# EAGLE design Arduino_Mini (EAGLE 9.1.3)
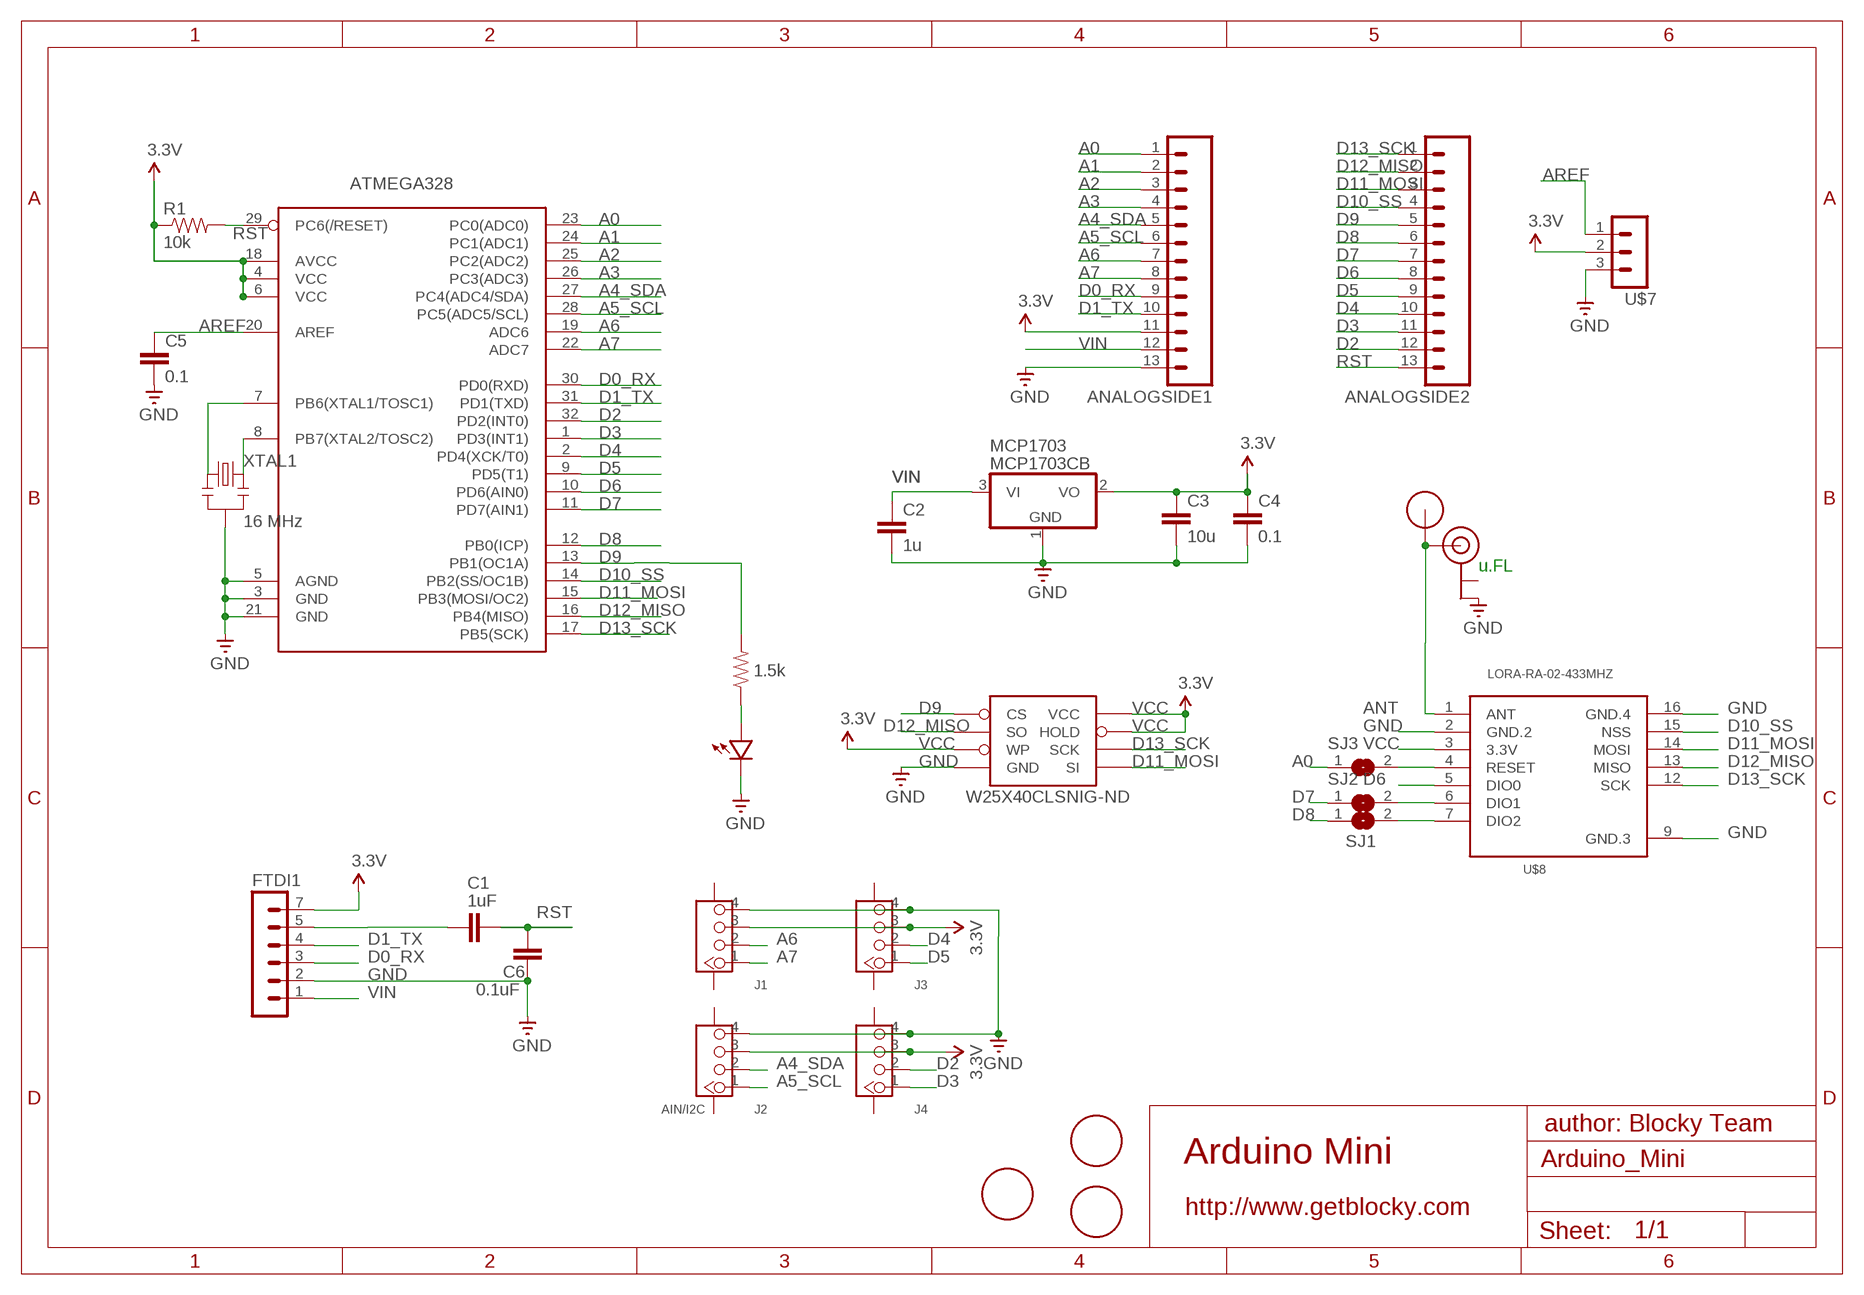
[diagram p0: schematic, sheet 1]

## Parts
ANALOGSIDE1  HDR_13PINTHIN_RINGS  [1X13_THINRINGS]
ANALOGSIDE2  HDR_13PINTHIN_RINGS  [1X13_THINRINGS]
ATMEGA328  ATMega-328  ATMEGA168/328TQFP32  [TQFP32-08]
C1  1uF  CAP0603-CAP  [0603-CAP]
C2  1u  CAP0603-CAP  [0603-CAP]
C3  10u  CAP0805-CAP  [0805-CAP]
C4  0.1  CAP0603-CAP  [0603-CAP]
C5  0.1  CAP0603-CAP  [0603-CAP]
C6  0.1uF  CAP0603-CAP  [0603-CAP]
FTDI1  HDR_6PINTHINRINGS  [1X06_NS_THINRINGS]
J1  4P-SMD-2.0-90D  GROVE-CONNECTOR-SMD-90D(4+2P-2.0)  [HW4-SMD-2.0-90D]
J2  AIN/I2C  GROVE-CONNECTOR-SMD-90D(4+2P-2.0)  [HW4-SMD-2.0-90D]
J3  4P-SMD-2.0-90D  GROVE-CONNECTOR-SMD-90D(4+2P-2.0)  [HW4-SMD-2.0-90D]
J4  4P-SMD-2.0-90D  GROVE-CONNECTOR-SMD-90D(4+2P-2.0)  [HW4-SMD-2.0-90D]
LED  LED0603  [0603-LED]
MCP1703  MCP1703CB  [SOT23]
R1  10k  RESISTOR0603-RES  [0603-RES]
R2  1.5k  RESISTOR0603-RES  [0603-RES]
SJ1  SOLDERJUMPERREFLOW  [SOLDERJUMPER_REFLOW]
SJ2  SOLDERJUMPERREFLOW  [SOLDERJUMPER_REFLOW]
SJ3  SOLDERJUMPERREFLOW  [SOLDERJUMPER_REFLOW]
U$1  RFM12B_ANTENNA""  [RFM12B-ANTENNA]
U$2  FIDUCIAL1.5MM  [FIDUCIAL_1.5MM]
U$4  U.FL  [U.FL]
U$5  FIDUCIAL1.5MM  [FIDUCIAL_1.5MM]
U$6  FIDUCIAL1.5MM  [FIDUCIAL_1.5MM]
U$7  HDR_3PINTHINRINGS  [1X03_NS_THINRINGS]
U$8  LORA-RA-02-433MHZ  [LORA-RA2-SMD]
W25X40CLSNIG-ND  AT25F512BJEDEC_3.9MM  [SO08]
XTAL1  16 MHz  RESONATORSMD  [RESONATOR-SMD]

## Nets
A0: ANALOGSIDE1.1 ATMEGA328.23(PC0(ADC0)) SJ3.1
A1: ANALOGSIDE1.2 ATMEGA328.24(PC1(ADC1))
A2: ANALOGSIDE1.3 ATMEGA328.25(PC2(ADC2))
A3: ANALOGSIDE1.4 ATMEGA328.26(PC3(ADC3))
A4_SDA: ANALOGSIDE1.5 ATMEGA328.27(PC4(ADC4/SDA)) J2.2
A5_SCL: ANALOGSIDE1.6 ATMEGA328.28(PC5(ADC5/SCL)) J2.1
A6: ANALOGSIDE1.7 ATMEGA328.19(ADC6) J1.2
A7: ANALOGSIDE1.8 ATMEGA328.22(ADC7) J1.1
ANT [power]: U$1.P$1 U$4.SIGNAL U$8.1(ANT)
AREF: ATMEGA328.20(AREF) C5.1 U$7.1
D0_RX: ANALOGSIDE1.9 ATMEGA328.30(PD0(RXD)) FTDI1.3
D1_TX: ANALOGSIDE1.10 ATMEGA328.31(PD1(TXD)) FTDI1.4
D2: ANALOGSIDE2.12 ATMEGA328.32(PD2(INT0)) J4.2
D3: ANALOGSIDE2.11 ATMEGA328.1(PD3(INT1)) J4.1
D4: ANALOGSIDE2.10 ATMEGA328.2(PD4(XCK/T0)) J3.2
D5: ANALOGSIDE2.9 ATMEGA328.9(PD5(T1)) J3.1
D6: ANALOGSIDE2.8 ATMEGA328.10(PD6(AIN0)) U$8.5(DIO0)
D7: ANALOGSIDE2.7 ATMEGA328.11(PD7(AIN1)) SJ2.1
D8: ANALOGSIDE2.6 ATMEGA328.12(PB0(ICP)) SJ1.1
D9: ANALOGSIDE2.5 ATMEGA328.13(PB1(OC1A)) R2.2 W25X40CLSNIG-ND.1_CS(CS)
D10_SS: ANALOGSIDE2.4 ATMEGA328.14(PB2(SS/OC1B)) U$8.15(NSS)
D11_MOSI: ANALOGSIDE2.3 ATMEGA328.15(PB3(MOSI/OC2)) U$8.14(MOSI) W25X40CLSNIG-ND.5_SI(SI)
D12_MISO: ANALOGSIDE2.2 ATMEGA328.16(PB4(MISO)) U$8.13(MISO) W25X40CLSNIG-ND.2_SO(SO)
D13_SCK: ANALOGSIDE2.1 ATMEGA328.17(PB5(SCK)) U$8.12(SCK) W25X40CLSNIG-ND.6_SCK(SCK)
DIO1: SJ2.2 U$8.6(DIO1)
DIO2: SJ1.2 U$8.7(DIO2)
GND: ANALOGSIDE1.13 ATMEGA328.3(GND) ATMEGA328.5(AGND) ATMEGA328.21(GND) C2.2 C3.2 C4.2 C5.2 C6.2 FTDI1.2 J1.4 J2.4 J3.4 J4.4 LED.MINUS MCP1703.1(GND) U$4.GND2(GND) U$7.3 U$8.2(GND.2) U$8.9(GND.3) U$8.16(GND.4) W25X40CLSNIG-ND.4_GND(GND) XTAL1.2
N$1: ATMEGA328.7(PB6(XTAL1/TOSC1)) XTAL1.1
N$2: LED.PLUS R2.1
N$3: SJ3.2 U$8.4(RESET)
N$5: C1.2 FTDI1.5
N$21: ATMEGA328.8(PB7(XTAL2/TOSC2)) XTAL1.3
RST: ANALOGSIDE2.13 ATMEGA328.29(PC6(/RESET)) C1.1 C6.1 R1.2
VCC [power]: ANALOGSIDE1.11 ATMEGA328.4(VCC) ATMEGA328.6(VCC) ATMEGA328.18(AVCC) C3.1 C4.1 FTDI1.7 J1.3 J2.3 J3.3 J4.3 MCP1703.2(VO) R1.1 U$7.2 U$8.3(3.3V) W25X40CLSNIG-ND.3_WP(WP) W25X40CLSNIG-ND.7_HOLD(HOLD) W25X40CLSNIG-ND.8_VCC(VCC) ; supply symbol labelled 3.3V
VIN [power]: ANALOGSIDE1.12 C2.1 FTDI1.1 MCP1703.3(VI)
Unconnected: J1.SS1 J1.SS2 J2.SS1 J2.SS2 J3.SS1 J3.SS2 J4.SS1 J4.SS2 U$2.P$1(FIDUCIAL) U$4.GND1(GND) U$5.P$1(FIDUCIAL) U$6.P$1(FIDUCIAL)

## Notes on the sheet
- u.FL
- author: Blocky Team
- Arduino Mini
- http://www.getblocky.com

## Library data of the parts
ANALOGSIDE1 ANALOGSIDE2 = LowPowerLab:HDR_13PIN
ATMEGA328 = LowPowerLab:ATMEGA168/328: Atmel 32-pin 8-bit micro, 16k flash.
C1-C6 = LowPowerLab:CAP: Capacitor Standard 0603 ceramic capacitor, and 0.1" leaded capacitor.
FTDI1 = LowPowerLab:HDR_6PIN
J1 J3 J4 = Seeed-Connector:GROVE-CONNECTOR-SMD-90D(4+2P-2.0): 320110032
J2 = Seeed-Connector:GROVE-CONNECTOR-SMD-90D(4+2P-2.0): 320110032; VALUE: 4P-SMD-2.0-90D
LED = LowPowerLab:LED
MCP1703 = linear:MCP1703: 250 mA, 16V, Low Quiescent Current LDO Regulator Source: http://ww1.microchip.com/downloads/en/DeviceDoc/22049b.pdf
R1 R2 = LowPowerLab:RESISTOR: Resistor Basic schematic elements and footprints for 0603, 1206, and PTH resistors.
SJ1-SJ3 = microbuilder:SOLDERJUMPER: SMD Solder JUMPER Solder the two pads together to create a connection, or remove the solder to break it. REFLOW - Use this footprint for solder paste and reflow ovens. WAVE - Use this footprint for hand-soldering (larger pads). CLOSED - Has a trace between the two pads to ensure it is closed by default. The trace needs to be cut to disable the jumper, and can be closed again by creating a solder bridge between the two pads.
U$1 = LowPowerLab:RFM12B_ANTENNA
U$2 U$5 U$6 = LowPowerLab:FIDUCIAL
U$4 = LowPowerLab:U.FL: SMD antenna connector- WRL-09144
U$7 = LowPowerLab:HDR_3PIN
U$8 = LikeCircuit:LORA-RA-02-433MHZ: 433 MHz Lora Ra-02 Radio Transceiver Module based on SX1276 chip. Visit our more eagle PCB <https://www.likecircuit.com/>
W25X40CLSNIG-ND = LowPowerLab:AT25F512B: 4-Mbit SPI flash memory
XTAL1 = SparkFun:RESONATOR: Resonator Small SMD resonator. This is the itty bitty 10/20MHz resonators with built in caps. CSTCE10M0G55 and CSTCE20M0V53. Footprint has been reviewed closely but hasn't been tested yet.

## Net classes
1 power: width 0.381 mm, clearance 0.254 mm
10 supply: width 0.254 mm

## Board
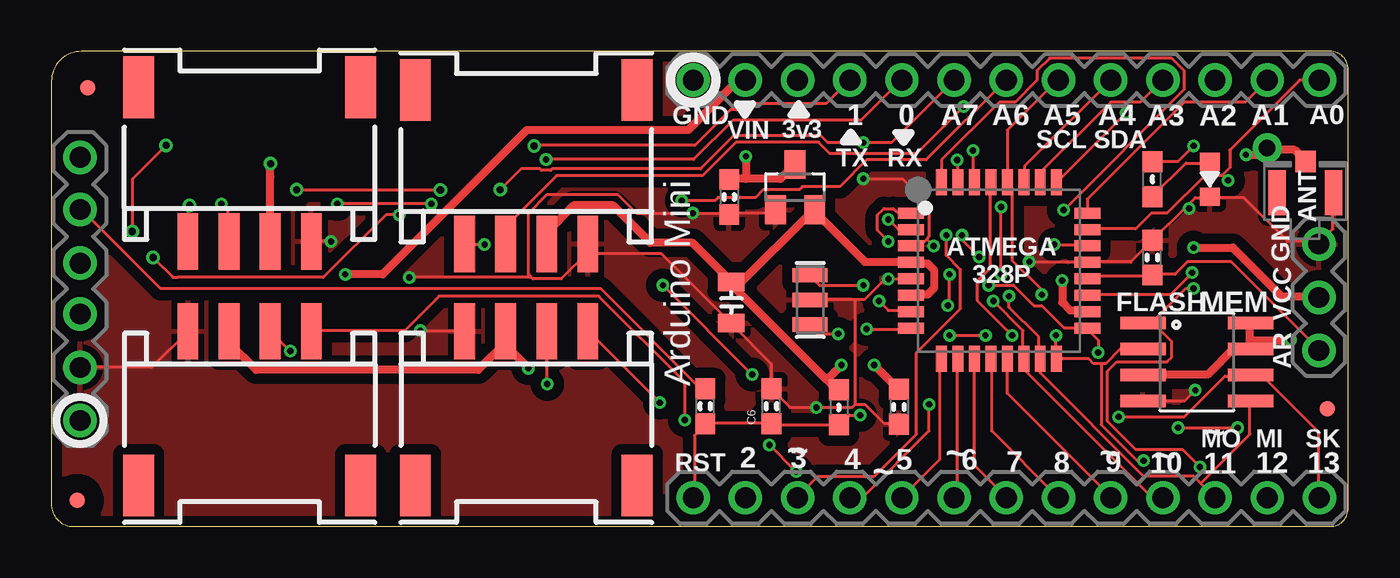
[diagram p1: board, top side]
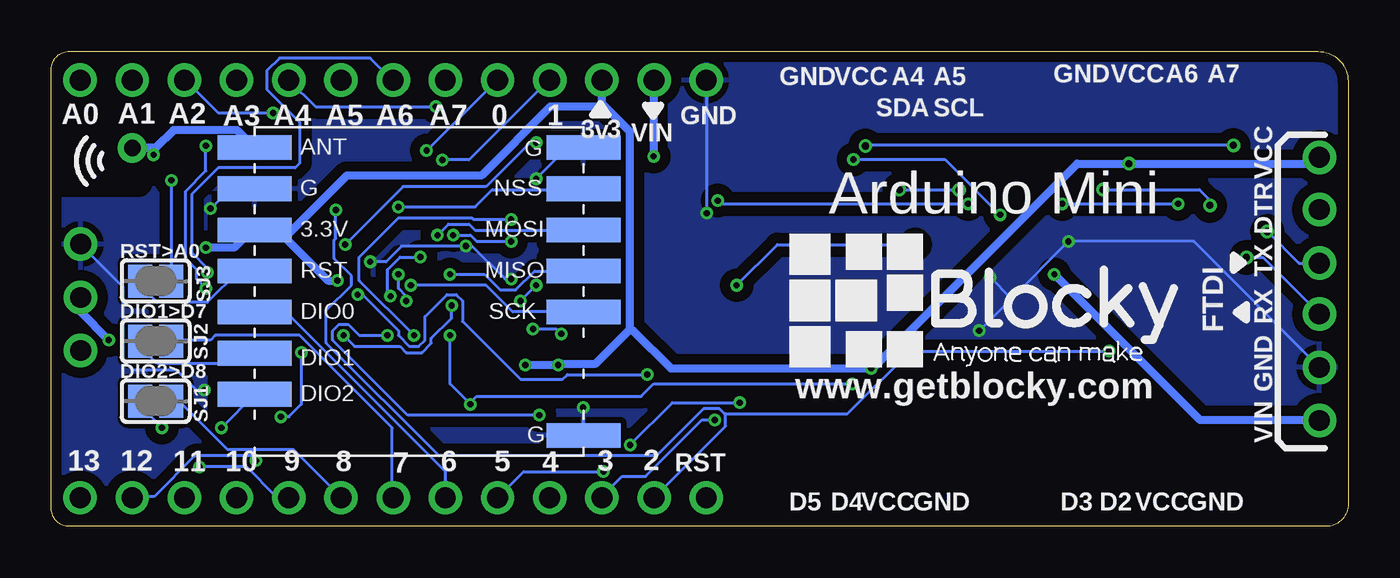
[diagram p2: board, bottom side, seen from below]

Size 63.12 x 23.11 mm. Coordinates in mm from the lower left corner, seen from the top.
Outline: 62.25,23.11 1.46,23.11 arc90 0,21.66 0,1.07 arc90 1.07,0 62.25,0 arc90 63.12,0.87 63.12,22.25 arc90 62.25,23.11
Copper layers (1*16): Top 0.035mm / dielectric 1.5mm / Bottom 0.035mm
Design rules "ITEADstudio_DRC *": minimum track width 6mil, minimum drill 12mil, track to track 6mil, track to pad 6mil, pad to pad 6mil, via to via 6mil, smd to smd 0mil, copper to edge 10mil, drill to drill 10mil, minimum pad ring 10mil, minimum via ring 6mil, stop-mask expansion 2mil, vias tented up to drill 100mil, thermal gap 12mil
tRestrict: area 60.3,15.1 to 61.7,16.9; area 59.1,18.7 to 62.7,19.2; area 62.3,17.4 to 62.5,17.5
bRestrict: area 58.8,16.7 to 62.8,19.4

### Footprints (pad centres in the part's own frame; a part is rotated, then mirrored left to right if it is on the bottom)
1X13_THINRINGS = drill 1.016 pad 1.626: 1 0,0; 2 2.54,0; 3 5.08,0; 4 7.62,0; 5 10.16,0; 6 12.7,0; 7 15.24,0; 8 17.78,0; 9 20.32,0; 10 22.86,0; 11 25.4,0; 12 27.94,0; 13 30.48,0
TQFP32-08 = smd 1.27 x 0.533: 1 -4.293,2.8; 2 -4.293,2; 3 -4.293,1.2; 4 -4.293,0.4; 5 -4.293,-0.4; 6 -4.293,-1.2; 7 -4.293,-2; 8 -4.293,-2.8; 17 4.293,-2.8; 18 4.293,-2; 19 4.293,-1.2; 20 4.293,-0.4; 21 4.293,0.4; 22 4.293,1.2; 23 4.293,2; 24 4.293,2.8 | smd 0.533 x 1.27: 9 -2.8,-4.293; 10 -2,-4.293; 11 -1.2,-4.293; 12 -0.4,-4.293; 13 0.4,-4.293; 14 1.2,-4.293; 15 2,-4.293; 16 2.8,-4.293; 25 2.8,4.293; 26 2,4.293; 27 1.2,4.293; 28 0.4,4.293; 29 -0.4,4.293; 30 -1.2,4.293; 31 -2,4.293; 32 -2.8,4.293
0603-CAP = smd 1.016 x 0.965: 1 -0.85,0; 2 0.85,0
0805-CAP = smd 0.902 x 1.3: 1 -1,0; 2 1,0
1X06_NS_THINRINGS = drill 1.016 pad 1.626: 1 -0.051,0; 2 2.527,0; 3 5.131,0; 4 7.607,0; 5 10.211,0; 7 12.751,0
HW4-SMD-2.0-90D = smd 1.01 x 2.74: 1 -3,-0.1; 2 -1,-0.1; 3 1,-0.1; 4 3,-0.1 | smd 1.5 x 3: SS1 -5.4,7.4; SS2 5.4,7.4
0603-LED = smd 0.864 x 0.965: MINUS -0.85,0; PLUS 0.85,0
SOT23 = smd 1 x 1.4: 1 -0.95,-1.1; 2 0.95,-1.1; 3 0,1.1
0603-RES = smd 1.016 x 0.965: 1 -0.85,0; 2 0.85,0
SOLDERJUMPER_REFLOW = smd 1.168 x 1.6: 1 -0.762,0; 2 0.762,0
RFM12B-ANTENNA = drill 0.8 pad 1.422: P$1 0,0
FIDUCIAL_1.5MM = smd 0.762 x 0.762: P$1 0,0
U.FL = smd 2.2 x 0.85: GND1 0,1.375; GND2 0,-1.375 | smd 1.05 x 1: SIGNAL 1.525,0
1X03_NS_THINRINGS = drill 1.016 pad 1.626: 1 -0.051,0; 2 2.527,0; 3 5.131,0
LORA-RA2-SMD = smd 3.6 x 1.2: 1 -8,7; 2 -8,5; 3 -8,3; 4 -8,1; 5 -8,-1; 6 -8,-3; 7 -8,-5; 9 8,-7; 12 8,-1; 13 8,1; 14 8,3; 15 8,5; 16 8,7
SO08 = smd 0.61 x 2.21: 1_CS -1.905,-2.616; 2_SO -0.635,-2.616; 3_WP 0.635,-2.616; 4_GND 1.905,-2.616; 5_SI 1.905,2.616; 6_SCK 0.635,2.616; 7_HOLD -0.635,2.616; 8_VCC -1.905,2.616
RESONATOR-SMD = smd 0.7 x 1.7: 1 -1.2,0; 2 0,0; 3 1.2,0

### Placement (x,y rotation side)
ANALOGSIDE1  61.72,21.72 180 top
ANALOGSIDE2  61.72,1.4 180 top
ATMEGA328  46.13,12.45 0 top
C1  31.83,5.84 90 top
C2  32.99,16.03 270 top
C3  33.1,10.9 270 top
C4  41.25,5.82 270 top
C5  53.59,13.08 90 top
C6  35.05,5.84 90 top
FTDI1  1.4,5.21 90 top
J1  9.65,13.97 0 top
J2  23.11,13.84 0 top
J3  23.11,9.4 180 top
J4  9.65,9.4 180 top
LED  56.39,16.89 90 top
MCP1703  36.2,16.51 0 top
R1  38.33,5.79 270 top
R2  53.59,16.89 90 top
SJ1  58.04,6.1 180 bottom
SJ2  58.04,9.02 180 bottom
SJ3  58.04,11.94 180 bottom
U$1  59.18,18.41 0 top
U$2  1.27,1.27 0 top
U$3  [BLOCKY_LOGO]  28.19,7.49 0 bottom
U$4  61.04,16.23 90 top
U$5  1.78,21.34 0 top
U$6  62.1,5.71 0 top
U$7  61.7,8.61 90 top
U$8  45.21,11.43 0 bottom
W25X40CLSNIG-ND  55.75,8 270 top
XTAL1  36.93,11.02 270 top

### Tracks (layer width: path | path; a pad name or v marks a point on that pad's centre or on a via)
A0  (via drill 0.3)
  Top 0.152: 57.01,17.11 57.35,17.45 57.35,18.31 60.76,21.72 61.7,21.72 ANALOGSIDE1.1 | 57.01,17.11 56.97,17.07 56.13,17.07 54.3,15.24 53.54,15.24 52.78,14.48 50.42,14.48 ATMEGA328.23 | v57.28,16.84 57.05,17.07 57.01,17.11
  Bottom 0.152: v57.28,16.84 57.28,11.96 SJ3.1
A1
  Top 0.152: ANALOGSIDE1.2 58.11,20.65 55.14,20.65 50.42,15.93 50.42,15.32 ATMEGA328.24
A2  (via drill 0.3)
  Top 0.152: v52.32,20.12 48.97,16.76 ATMEGA328.25
  Bottom 0.152: v52.32,20.12 54.99,20.12 56.59,21.72 ANALOGSIDE1.3
A3
  Top 0.152: ATMEGA328.26 48.13,16.76 48.13,17.22 51.56,20.65 53.01,20.65 54.08,21.72 ANALOGSIDE1.4
A4_SDA  (via drill 0.3)
  Top 0.152: ANALOGSIDE1.5 47.37,17.53 47.37,16.76 ATMEGA328.27 | v44.4,20.42 42.11,18.14 37.9,18.14 37.34,18.69 33.32,18.69 31.7,17.07 24.59,17.07 22.15,14.63 22.15,13.79 J2.2
  Bottom 0.152: v44.4,20.42 50.27,20.42 ANALOGSIDE1.5
A5_SCL  (via drill 0.3)
  Top 0.152: ANALOGSIDE1.6 48.97,21.72 46.53,19.28 46.53,16.76 ATMEGA328.28 46.53,16.69 46.76,16.46 46.76,12.95 48.21,11.51 v48.21,11.28 | v21.08,13.72 20.17,13.72 J2.1 | v34.11,7.39 v29.77,11.73
  Bottom 0.152: v21.08,13.72 27.79,13.72 v29.77,11.73 | v34.11,7.39 38,7.39 38.23,7.16 40.28,7.16 43.1,9.98 43.1,10.97 43.41,11.28 43.87,11.28 44.93,10.21 44.93,9.07 45.24,8.76 45.7,8.76 46.23,9.3 46.23,9.53 47.98,11.28 v48.21,11.28
A6  (via drill 0.3)
  Top 0.152: v55.52,12.34 54.46,11.28 50.42,11.28 ATMEGA328.19 | v8.28,15.7 8.58,15.39 8.58,13.95 J1.2 | v18.49,15.7 v13.92,15.7 | v30.68,15.85 32.28,15.85 32.44,16 34.27,16 34.65,16.38 36.4,16.38 36.55,16.54 38.38,16.54 39.67,17.83 42.57,17.83 46.46,21.72 ANALOGSIDE1.7
  Bottom 0.152: v55.52,12.34 55.52,12.57 56.29,13.34 56.29,16.15 54.99,17.45 51.26,17.45 51.03,17.68 51.03,19.66 52.63,21.26 52.63,22.17 52.02,22.78 47.6,22.78 46.53,21.72 ANALOGSIDE1.7 | v13.92,15.7 v8.28,15.7 | v18.49,15.7 30.53,15.7 v30.68,15.85
A7  (via drill 0.3, 0.35)
  Top 0.152: v48.82,13.72 50.42,13.72 ATMEGA328.22 | ANALOGSIDE1.8 40.89,18.67 v39.52,18.67 37.79,18.67 37.46,19 33.2,19 31.6,17.4 24.38,17.4 24.3,17.32 23.86,17.32 23.78,17.4 22.86,17.4 v21.84,16.38 | v18.93,16.37 11.97,16.37 11.96,16.36 v11.94,16.38 | v6.73,15.62 6.65,15.54 J1.1
  Bottom 0.152: v48.82,13.72 46,16.54 41.96,16.54 39.83,18.67 v39.52,18.67 | v18.93,16.37 18.95,16.38 v21.84,16.38 | v11.94,16.38 7.24,16.38 6.73,15.88 v6.73,15.62
ANT  (via drill 0.3)
  Top 0.381: U$4.SIGNAL 61.01,17.83 60.52,18.33 59.18,18.33 58.74,18.09 v58.14,18.09
  Bottom 0.381: U$8.1 53.24,18.44 54.08,19.28 55.91,19.28 57.17,19.28 58.04,18.41 58.27,18.41 | 58.27,18.41 58.49,18.41 | 58.49,18.41 | 58.49,18.41 | U$1.P$1 58.5,18.41 58.49,18.41 | v58.14,18.09 58.14,18.16 58.27,18.29 58.27,18.41
AREF
  Top 0.152: ATMEGA328.20 50.42,12.12 50.49,12.19 53.54,12.19 C5.1 53.62,12.27 54.69,12.27 55.3,12.88 57.43,12.88 61.7,8.61 U$7.1
D0_RX  (via drill 0.3, 0.35)
  Top 0.152: v44.86,18.29 44.86,16.76 ATMEGA328.30 | v16.94,15.16 16.28,15.16 13.23,12.12 6.15,12.12 5.92,12.12 v4.95,13.08 | v24.08,17.86 31.27,17.86 33.17,19.76 39.39,19.76 41.35,21.72 ANALOGSIDE1.9
  Bottom 0.152: v44.86,18.29 41.43,21.72 ANALOGSIDE1.9 | v16.94,15.16 19.63,17.86 v24.08,17.86 | FTDI1.3 4.14,13.08 v4.95,13.08
D1_TX  (via drill 0.3, 0.35)
  Top 0.152: v44.09,17.83 44.09,16.76 ATMEGA328.31 | ANALOGSIDE1.10 38.84,21.72 37.69,20.57 33.66,20.57 33.35,20.27 33.05,20.27 31.32,18.54 23.53,18.54 v23.49,18.51 | v5.59,18.54 3.94,16.89 v3.94,14.35
  Bottom 0.152: v44.09,17.83 42.8,17.83 38.91,21.72 ANALOGSIDE1.10 | v3.94,14.35 2.4,12.81 FTDI1.4 | v5.59,18.54 5.65,18.61 5.69,18.57 23.44,18.57 v23.49,18.51
D2  (via drill 0.3)
  Top 0.152: v49.28,15.39 55.14,21.26 55.14,22.17 54.53,22.78 48.59,22.78 47.98,22.17 47.98,21.72 46.91,20.65 46.15,20.65 43.33,17.83 43.33,16.76 ATMEGA328.32 | v11.63,8.53 10.72,9.45 J4.2
  Bottom 0.152: v49.28,15.39 49.28,14.02 49.35,13.95 49.35,13.03 48.51,12.19 48.51,11.73 49.73,10.52 49.73,8.91 44.25,3.43 33.66,3.43 31.37,5.71 30.61,5.71 30.34,5.45 | 30.34,5.45 30.3,5.41 30.3,4.88 33.73,1.45 ANALOGSIDE2.12 | v11.63,8.53 21.31,8.53 24.36,5.49 30.3,5.49 30.34,5.45
D3  (via drill 0.3)
  Top 0.152: v40.74,13.87 40.21,14.4 40.21,15.16 40.51,15.47 40.97,15.47 41.12,15.32 41.81,15.32 ATMEGA328.1 | v43.56,14.17 43.56,13.18 44.25,12.5 44.25,10.59 42.11,8.46 42.11,4.5 40.06,2.44 37.31,2.44 36.32,1.45 ANALOGSIDE2.11 | v30.84,5.18 30.84,7.01 26.64,11.2 18.87,11.2 17.2,9.53 12.7,9.53 J4.1
  Bottom 0.152: v40.74,13.87 42.42,13.87 42.72,14.17 v43.56,14.17 | v30.84,5.18 31.45,5.18 34.19,2.44 35.33,2.44 36.32,1.45 ANALOGSIDE2.11
D4  (via drill 0.3)
  Top 0.152: v40.74,14.94 41.2,14.48 41.81,14.48 ATMEGA328.2 | v43.71,9.3 v45.47,9.3 | v42.72,5.94 42.72,4.65 39.52,1.45 38.91,1.45 ANALOGSIDE2.10 | v24.13,6.93 24.13,9.45 J3.2
  Bottom 0.152: v40.74,14.94 42.57,14.94 42.65,15.01 46.23,15.01 48.13,13.11 48.13,11.96 v45.47,9.3 | v43.71,9.3 43.71,6.93 v42.72,5.94 42.72,6.02 42.42,6.33 34.42,6.33 33.81,6.93 v24.13,6.93
D5  (via drill 0.3)
  Top 0.152: ATMEGA328.9 43.26,8.15 43.26,3.28 41.43,1.45 ANALOGSIDE2.9 | v29.62,6.02 26.19,9.45 J3.1 | v36.25,2.67 v34.95,3.96
  Bottom 0.152: v29.62,6.02 32.89,6.02 v34.95,3.96 | v36.25,2.67 40.13,2.67 41.35,1.45 ANALOGSIDE2.9
D6
  Top 0.152: ATMEGA328.10 44.09,8.15 44.09,1.6 43.94,1.45 ANALOGSIDE2.8
  Bottom 0.152: U$8.5 53.16,10.36 51.64,10.36 43.94,2.67 43.94,1.45 ANALOGSIDE2.8
D7
  Top 0.152: ATMEGA328.11 44.93,2.97 46.46,1.45 ANALOGSIDE2.7
  Bottom 0.152: SJ2.1 57.28,9.07 55.37,9.07 55.14,9.3 51.03,9.3 46.53,4.8 46.53,1.45 ANALOGSIDE2.7
D8
  Top 0.152: ATMEGA328.12 45.77,8.15 45.77,4.65 48.97,1.45 ANALOGSIDE2.6
  Bottom 0.152: SJ1.1 56.9,6.1 54.53,3.73 51.33,3.73 49.05,1.45 ANALOGSIDE2.6
D9  (via drill 0.3)
  Top 0.152: v55.6,18.52 54.84,17.75 53.62,17.75 R2.2 | v55.6,11.58 55.22,11.58 53.54,9.91 53.16,9.91 W25X40CLSNIG-ND.1_CS 53.62,9.91 54.53,8.99 54.53,8.23 54.3,8 51.87,8 51.41,7.54 51.41,5.11 52.78,3.73 55.07,3.73 v55.91,2.9 | ATMEGA328.13 46.53,6.48 51.56,1.45 ANALOGSIDE2.5
  Bottom 0.152: v55.6,18.52 55.6,17.3 56.59,16.31 56.59,13.03 56.06,12.5 56.06,12.04 v55.6,11.58 | v55.91,2.9 53.62,2.9 52.17,1.45 51.56,1.45 ANALOGSIDE2.5
D10_SS  (via drill 0.3)
  Top 0.152: ANALOGSIDE2.4 54.08,1.45 53.54,1.45 47.37,7.62 47.37,8.15 ATMEGA328.14 47.3,8.15 47.3,9.53 v45.85,10.97 | v46.23,12.27 v46.23,15.54
  Bottom 0.152: v46.23,15.54 42.49,15.54 41.66,16.38 37.24,16.38 U$8.15 | v46.23,12.27 46.23,11.58 45.85,11.2 v45.85,10.97
D11_MOSI  (via drill 0.3)
  Top 0.152: 55.94,2.1 56.59,1.45 ANALOGSIDE2.3 | 55.94,2.1 55.6,2.44 53.16,2.44 48.13,7.47 ATMEGA328.15 48.06,8.15 48.06,9.22 46.61,10.67 v46.61,11.2 | W25X40CLSNIG-ND.5_SI 58.34,6.1 58.34,4.5 55.98,2.13 55.94,2.1 | v44.32,14.17 44.32,13.95 v45.16,13.11
  Bottom 0.152: v44.32,14.17 43.79,14.71 42.8,14.71 42.49,14.4 37.24,14.4 U$8.14 | v45.16,13.11 46.15,13.11 46.76,12.5 46.76,11.35 v46.61,11.2
D12_MISO  (via drill 0.3)
  Top 0.152: 51.11,7.92 51.33,7.92 52.02,8.61 53.09,8.61 W25X40CLSNIG-ND.2_SO | 51.11,7.92 50.72,7.92 50.49,8.15 48.97,8.15 ATMEGA328.16 48.89,8.15 v48.89,9.3 | v53.16,3.2 52.86,3.2 51.11,4.95 51.11,7.92 | v43.71,12.27 43.71,10.82 v43.64,10.74
  Bottom 0.152: v53.16,3.2 53.39,3.43 56.13,3.43 58.11,1.45 59.18,1.45 ANALOGSIDE2.2 | v43.71,12.27 42.04,12.27 41.27,11.51 40.51,11.51 39.6,12.42 37.24,12.42 U$8.13 | v43.64,10.74 43.64,10.13 44.63,9.14 44.63,8.91 45.09,8.46 45.85,8.46 46.15,8.76 48.36,8.76 v48.89,9.3
D13_SCK  (via drill 0.3)
  Top 0.152: ANALOGSIDE2.1 61.7,1.45 61.7,4.57 58.95,7.32 58.42,7.32 W25X40CLSNIG-ND.6_SCK 58.34,7.32 57.12,7.32 55.14,5.33 v51.94,5.33 | v45.62,11.73 46.84,11.73 47.83,10.74 48.21,10.74 49.28,9.68 50.42,9.68 ATMEGA328.17 50.42,9.6 50.95,9.07 v50.95,8.46
  Bottom 0.152: v45.62,11.73 41.96,11.73 40.66,10.44 37.24,10.44 U$8.12 | v51.94,5.33 51.56,5.33 50.95,5.94 v50.95,8.46
DIO1
  Bottom 0.152: SJ2.2 58.8,8.99 58.8,8.76 57.96,7.92 53.7,7.92 53.24,8.38 U$8.6
DIO2  (via drill 0.3)
  Top 0.152: v54.84,4.8 v57.73,4.8
  Bottom 0.152: SJ1.2 58.8,5.87 v57.73,4.8 | v54.84,4.8 53.24,6.4 U$8.7
GND  (via drill 0.3)
  Top 0.152: 1.42,7.77 FTDI1.2 4.89,7.73 J4.4 | v13.61,13.87 12.7,13.87 J1.4 | v17.96,9.53 20.09,9.53 J3.4 | 55.26,15.58 53.62,13.95 C5.2 53.54,13.87 52.55,12.88 50.42,12.88 | 55.26,15.58 55.68,16 56.36,16 LED.MINUS 56.44,16 58.04,16 60.17,13.87 61.7,13.87 U$7.3 61.7,13.79 62.38,14.48 62.38,16.23 U$4.GND2 | 50.42,12.88 ATMEGA328.21 50.42,12.88 | v55.37,15.47 55.3,15.54 55.26,15.58 | v55.68,6.63 55.14,6.1 53.16,6.1 W25X40CLSNIG-ND.4_GND | MCP1703.1 35.18,15.39 35.03,15.24 33.05,15.24 C2.2 32.97,15.24 v31.22,15.24 28.47,15.24 27.56,16.15 24.13,16.15 23.22,15.24 23.22,12.27 23.33,12.15 | 23.33,12.15 23.44,12.04 24.82,12.04 26.11,13.34 26.11,13.72 J2.4 26.11,13.26 29.69,13.26 33.05,9.91 C3.2 33.12,9.83 35.03,7.92 35.03,6.71 C6.2 35.1,6.63 35.94,5.79 v37.24,5.79 38.99,5.79 39.14,5.94 | 42.61,13.98 42.72,14.1 42.72,15.62 41.43,16.92 v39.52,16.92 | 42.61,13.98 42.34,13.72 41.88,13.72 ATMEGA328.3 | 39.14,11.05 36.93,11.05 XTAL1.2 | 39.14,11.05 39.6,11.05 40.59,12.04 v40.74,12.04 41.81,12.04 ATMEGA328.5 | 39.14,5.94 39.6,5.94 40.51,5.03 41.2,5.03 C4.2 | 39.14,5.94 39.14,11.05 | v42.95,13.64 42.65,13.95 42.61,13.98 | v47.6,12.88 50.42,12.88 | v17.42,12.12 23.29,12.12 23.33,12.15
  Bottom 0.152: FTDI1.2 1.42,7.77 7.52,13.87 v13.61,13.87 16.4,11.09 | 16.4,11.09 v17.96,9.53 | v55.37,15.47 54.46,16.38 53.24,16.38 U$8.2 | v55.68,6.63 56.06,6.63 57.05,7.62 59.18,7.62 59.64,8.08 59.64,11.66 61.7,13.72 U$7.3 | v31.22,15.24 31.22,21.72 ANALOGSIDE1.13 | v39.52,16.92 38.08,18.36 37.24,18.36 U$8.16 | v37.24,5.79 37.24,4.5 U$8.9 | v40.74,12.04 41.05,12.04 42.65,13.64 v42.95,13.64 46.08,13.64 46.84,12.88 v47.6,12.88 | v17.42,12.12 16.43,11.12 16.4,11.09
  pour Bottom (isolate 0.508): 0.11,23.01 0.11,0.1 63.27,0.1 63.27,23.01
  pour Top (isolate 0.508): 0.19,23.01 0.19,0.1 63.27,0.1 63.27,23.01
N$1  (via drill 0.3)
  Top 0.152: v40.28,10.97 40.74,10.52 41.81,10.52 ATMEGA328.7 | v39.52,11.73 37.39,11.73 36.93,12.19 XTAL1.1
  Bottom 0.152: v39.52,11.73 v40.28,10.97
N$2
  Top 0.152: LED.PLUS 56.36,17.68 55.22,17.68 53.62,16.08 R2.1
N$3
  Bottom 0.152: SJ3.2 58.8,11.89 58.8,11.73 57.96,10.9 55.52,10.9 54,12.42 53.24,12.42 U$8.4
N$5
  Top 0.152: C1.2 31.83,6.71 31.6,6.71 26.72,11.58 5.31,11.58 1.42,15.47 FTDI1.5
N$21  (via drill 0.3)
  Top 0.152: v39.67,9.6 41.81,9.6 ATMEGA328.8 | v38.3,9.37 37.31,9.37 36.93,9.75 XTAL1.3
  Bottom 0.152: v39.67,9.6 38.53,9.6 v38.3,9.37
RST  (via drill 0.3)
  Top 0.152: v46.76,9.3 45.09,10.97 45.09,11.96 45.7,12.57 45.7,16.69 ATMEGA328.29 | v39.37,5.41 38.84,5.41 38.38,4.95 R1.2 38.3,4.95 35.1,4.95 C6.1 35.03,5.03 31.83,5.03 C1.1 31.83,4.95 31.29,4.42 31.29,1.45 ANALOGSIDE2.13
  Bottom 0.152: v46.76,9.3 48.13,9.3 48.67,9.83 49.12,9.83 49.43,9.53 49.43,9.07 45.77,5.41 v39.37,5.41
VCC  (via drill 0.3, 0.35)
  Top 0.381: 10.64,13.95 J1.3 10.65,17.01 10.64,17.02 10.64,17.63 v10.67,17.65 | 1.42,17.91 FTDI1.7 | J4.3 8.66,9.45 8.66,8.91 9.96,7.62 20.78,7.62 22.07,8.91 22.07,9.45 J3.3 22.15,8.76 v23.22,7.7 | W25X40CLSNIG-ND.3_WP 53.16,7.39 56.29,7.39 57.51,8.61 58.34,8.61 W25X40CLSNIG-ND.7_HOLD 58.34,8.76 58.34,9.07 | 58.34,9.07 58.34,9.91 W25X40CLSNIG-ND.8_VCC | v60.33,9.07 58.5,9.07 58.34,9.07 | v49.2,11.96 49.2,10.9 49.58,10.52 50.42,10.52 ATMEGA328.18 | ATMEGA328.6 41.88,11.28 42.65,11.28 42.95,11.58 42.95,12.5 42.65,12.8 41.88,12.8 ATMEGA328.4 41.66,12.88 39.6,12.88 37.24,15.24 MCP1703.2 37.08,15.39 33.35,11.66 C3.1 | 37.73,7.12 33.12,11.73 33.12,11.89 C3.1 | 37.73,7.12 38.15,6.71 38.3,6.71 R1.1 | v40.06,7.85 41.2,6.71 C4.1 | v38.46,7.85 37.85,7.24 37.73,7.12 | J2.3 24.13,13.79 24.13,14.33 25.42,15.62 27.33,15.62 29.16,13.79 31.22,13.79 32.97,12.04 C3.1 | v55.6,13.56 57.51,13.56 59.87,11.2 61.7,11.2 U$7.2
  Bottom 0.381: v60.33,9.07 61.7,10.44 61.7,11.12 U$7.2 | v49.2,11.96 49.66,11.96 52.09,14.4 53.16,14.4 U$8.3 | v40.06,7.85 v38.46,7.85 38.3,7.92 36.63,7.92 34.95,9.6 | 36.32,20.57 ANALOGSIDE1.11 | 36.32,20.57 34.95,19.2 34.95,9.6 | U$8.3 51.64,14.17 48.74,17.07 42.19,17.07 38.84,20.42 36.4,20.42 36.32,20.57 | v55.6,13.56 54.23,13.56 53.39,14.4 U$8.3 | 34.95,9.6 34.8,9.53 32.97,7.7 v23.22,7.7 23.06,7.77 13.18,17.65 v10.67,17.65 1.55,17.65 FTDI1.7
VIN  (via drill 0.3)
  Top 0.381: 33.81,16.92 35.48,16.92 36.17,17.6 MCP1703.3 | 33.81,16.92 33.05,16.92 C2.1 | v33.81,18.01 33.81,17.07 33.81,16.92 | v14.3,12.27 16.13,12.27 23.14,19.28 30.99,19.28 33.43,21.72 33.73,21.72 ANALOGSIDE1.12
  Bottom 0.381: v33.81,18.01 33.81,21.72 ANALOGSIDE1.12 | v14.3,12.27 7.21,5.18 1.42,5.18 FTDI1.1

### Text on the board
tPlace: 1 | 0 | A7 | A6 | A5 | A4 | A1 | GND | VIN | 3 | v | 3 | A3 | A2 | A0 | TX | RX | SCL | SDA | ANT | VCC | GND | Arduino Mini | ATMEGA / 328P | FLASH | MEM | AR | 2 | 3 | 4 | 5 | 6 | 7 | 8 | 9 | 10 | MO | ~ | 11 | MI | 12 | SK | 13 | RST | ~ | ~ | ~ | ~ | ~
bPlace: A7 | A6 | VCC | GND | A5 | A4 | VCC | GND | 1 | 0 | A7 | A6 | A5 | A4 | A2 | A1 | A0 | SCL | SDA | GND | VIN | 3 | v | 3 | A3 | VCC | Arduino Mini | DTR | RST>A0 | TX | RX | DIO1>D7 | FTDI | GND | DIO2>D8 | VIN | 2 | 3 | 4 | 5 | 6 | 7 | 8 | 9 | 10 | 11 | 12 | 13 | RST | GND | VCC | D2 | D3 | GND | VCC | D4 | D5